# EAGLE schematic GaggiaBabyClassWiring (EAGLE 7.2.0)
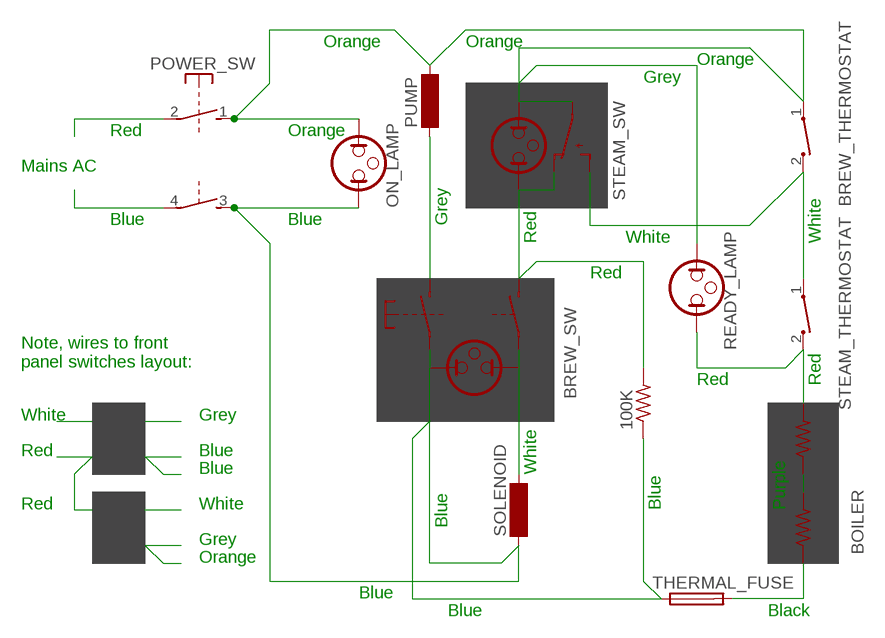
[diagram p0: schematic, sheet 1]

## Parts
100K  R-US_0204/2V  [0204V]
100K2  R-US_0204/2V  [0204V]
BOILER  R-US_0204/2V  [0204V]
BR_LMP  NEON  [LDH-3R]
BREW_SW  PVA1  [PVA1F]
BREW_THERMOSTAT  CT10-XXXX-A2  [CT10-XXXX-A2]
ON_LAMP  NEON  [LDH-3R]
POWER_SW  PVA1  [PVA1F]
PUMP  SM-L15A  [SM-L15A]
READY_LAMP  NEON  [LDH-3R]
SOLENOID  SM-L15A  [SM-L15A]
ST_LMP  NEON  [LDH-3R]
STEAM_SW  TL32PO  [TL3XPO]
STEAM_THERMOSTAT  CT10-XXXX-A2  [CT10-XXXX-A2]
THERMAL_FUSE  19559  [19559]

## Nets
N$1: POWER_SW.2(1:P)
N$2: POWER_SW.4(2:P)
N$3: 100K2.2 READY_LAMP.1 STEAM_THERMOSTAT.2
N$4: 100K.1 BR_LMP.2 BREW_SW.2(1:P) ON_LAMP.1 POWER_SW.3(2:S) SOLENOID.1 THERMAL_FUSE.1
N$5: BREW_SW.1(1:S) PUMP.1
N$6: 100K2.1 BOILER.2
N$7: BR_LMP.1 BREW_SW.4(2:P) SOLENOID.2
N$8: 100K.2 BREW_SW.3(2:S) ST_LMP.1 STEAM_SW.1(O)
N$9: BREW_THERMOSTAT.2 STEAM_SW.3(S) STEAM_THERMOSTAT.1
N$10: BREW_THERMOSTAT.1 ON_LAMP.2 POWER_SW.1(1:S) PUMP.2 READY_LAMP.2 ST_LMP.2 STEAM_SW.2(P)
N$11: BOILER.1 THERMAL_FUSE.2

## Notes on the sheet
- Orange | Orange
- Orange
- Grey
- Red | Orange
- Mains AC
- Blue | Blue | Grey
- Red | White | White
- Red
- Note, wires to front
  panel switches layout:
- Red | Red
- White | Grey
- Red | Blue
- Blue | White
- Red | White | Blue | Purple
- Blue
- Grey
- Orange
- Blue
- Blue | Black

## Library data of the parts
100K 100K2 BOILER = rcl:R-US_: RESISTOR, American symbol
BR_LMP ON_LAMP READY_LAMP ST_LMP = special:NEON: Neon LAMP
BREW_SW POWER_SW = switch-misc:PVA1: ITT SWITCH
BREW_THERMOSTAT STEAM_THERMOSTAT = switch-coto:CT10-XXXX-: CT10 Series Molded Switch Source: www.cotorelay.com .. Coto_Technology__CT10-1530-G1.pdf
PUMP SOLENOID = inductor-neosid:SM-L15: INDUCTOR SMD air coil with pick and place cap; OC_FARNELL: unknown; OC_NEWARK: unknown
STEAM_SW = switch:TL32PO: TINY SWITCH ON - MOM Source: http://www2.produktinfo.conrad.com/datenblaetter/700000-724999/705152-da-01-de-Subminiaturschalter_TL_36YO.pdf
THERMAL_FUSE = fuse:19559: FUSE HOLDER TR5, Wickmann; MPN: 55900000001; OC_FARNELL: 9516360; OC_NEWARK: 02P0286